# Altium schematic sheet LPCB227 - ACCELS.SchDoc
size A3; Address1: Factory 10; Address2: 9-13 Dingley Avenue, Dandeong, VICTORIA 3175, AUSTRALIA; DocumentNumber: 2; Revision: 1; SheetNumber: 2; SheetTotal: 4; Lockie__PCB_SUB_ASSEMBLY: Accelerometers; Lockie__PCB_ASSEMBLY: Main; Lockie__LDL: LPCB227; Lockie__PCB_DESCRIPTION: Accelerometer Module
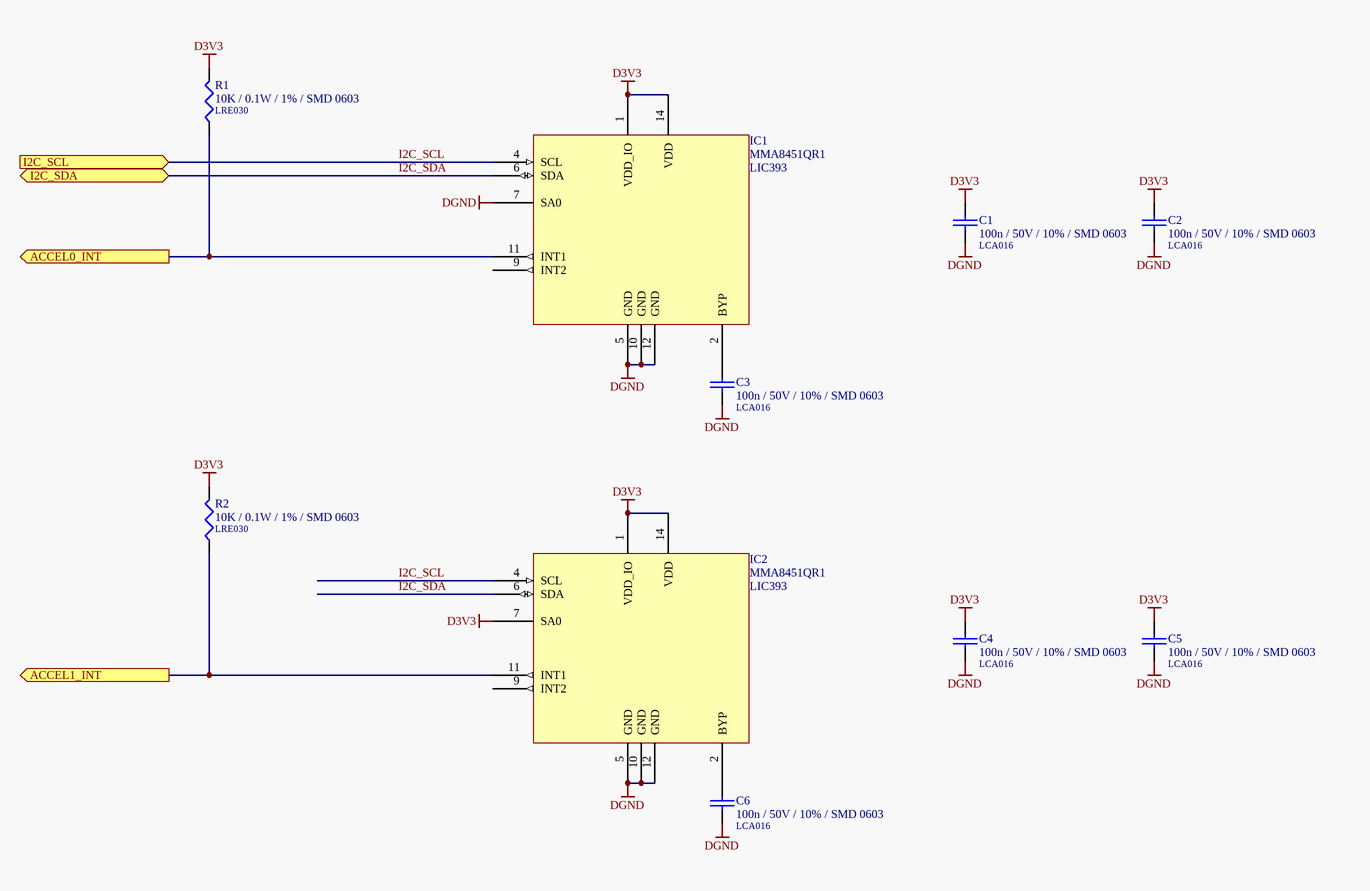
[diagram p0: LPCB227 - ACCELS.SchDoc]

## Parts
C1  100n / 50V / 10% / SMD 0603  LDL_NUMBER: LCA016  [LFP011__CC1608-0603-IPC7351_B]
C2  100n / 50V / 10% / SMD 0603  LDL_NUMBER: LCA016  [LFP011__CC1608-0603-IPC7351_B]
C3  100n / 50V / 10% / SMD 0603  LDL_NUMBER: LCA016  [LFP011__CC1608-0603-IPC7351_B]
C4  100n / 50V / 10% / SMD 0603  LDL_NUMBER: LCA016  [LFP011__CC1608-0603-IPC7351_B]
C5  100n / 50V / 10% / SMD 0603  LDL_NUMBER: LCA016  [LFP011__CC1608-0603-IPC7351_B]
C6  100n / 50V / 10% / SMD 0603  LDL_NUMBER: LCA016  [LFP011__CC1608-0603-IPC7351_B]
IC1  MMA8451QR1  LDL_NUMBER: LIC393  [LFP051__QFN16]
IC2  MMA8451QR1  LDL_NUMBER: LIC393  [LFP051__QFN16]
R1  10K / 0.1W / 1% / SMD 0603  LDL_NUMBER: LRE030  [LFP020__CR1608-0603-IPC7351_B]
R2  10K / 0.1W / 1% / SMD 0603  LDL_NUMBER: LRE030  [LFP020__CR1608-0603-IPC7351_B]

## Ports
ACCEL0_INT (out), ACCEL1_INT (out), I2C_SCL (in), I2C_SDA (bidir)

## Nets
D3V3: C1.1 C2.1 C4.1 C5.1 IC1.1(VDD_IO) IC1.14(VDD) IC2.1(VDD_IO) IC2.7(SA0) IC2.14(VDD) R1.2 R2.2
DGND: C1.2 C2.2 C3.2 C4.2 C5.2 C6.2 IC1.5(GND) IC1.7(SA0) IC1.10(GND) IC1.12(GND) IC2.5(GND) IC2.10(GND) IC2.12(GND)
ACCEL0_INT: IC1.11(INT1) R1.1 ; port ACCEL0_INT
ACCEL1_INT: IC2.11(INT1) R2.1 ; port ACCEL1_INT
I2C_SCL: IC1.4(SCL) IC2.4(SCL) ; port I2C_SCL
I2C_SDA: IC1.6(SDA) IC2.6(SDA) ; port I2C_SDA
NetC3_1: C3.1 IC1.2(BYP)
NetC6_1: C6.1 IC2.2(BYP)

Not connected (* = marked no-connect by the designer): IC1 9(INT2); IC2 9(INT2)

## Notes on the sheet
- PCB COMPONENT DESCRIPTION
- LDL NUMBER
- Assembly Details
- Size
- Drawing File Name
- Revision
- http://rloop.org
- Scale
- A3
- Sheet Details
- N.T.S
- Sheet:
- Of:

## Library data of the parts
C1-C6 = 100n / 50V / 10% / SMD 0603: Capacitor, Ceramic Chip, 100nF (0.1uF), 50V, 5%, SMD 0603 [LCA016]; FMEDA__OPERATING__VOLTAGE_MIN: 0; FMEDA__OPERATING__VOLTAGE_MAX: 3.3; FMEDA__OPERATING__TEMP_MIN: -20; FMEDA__OPERATING__TEMP_TYP: 27; FMEDA__OPERATING__TEMP_MAX: 50; FMEDA__CHANNEL: COM; Value: 100n; FMEDA__FUNCTION_IN_SYSTEM: *; FMEDA__OPERATING__VOLTAGE_TYP: 3.3
IC1 IC2 = MMA8451QR1: IC, Accelerometer, 3-Axis, 3.3V, I2C, SMD QFN16 [LIC393]; FMEDA__OPERATING__TEMP_MAX: 50; FMEDA__OPERATING__TEMP_MIN: -20; FMEDA__OPERATING__TEMP_TYP: 27; FMEDA__OPERATING__VOLTAGE_MAX: 3.3; FMEDA__OPERATING__VOLTAGE_MIN: 0; FMEDA__CHANNEL: COM; FMEDA__OPERATING__VOLTAGE_TYP: 3.3; FMEDA__FUNCTION_IN_SYSTEM: *
R1 R2 = 10K / 0.1W / 1% / SMD 0603: Resistor, Ceramic Chip, 10K, 0.1W, 1%, SMD 0603 [LRE030]; FMEDA__OPERATING__POWER_MAX: 0; FMEDA__OPERATING__TEMP_MAX: 50; FMEDA__OPERATING__TEMP_MIN: -20; FMEDA__OPERATING__TEMP_TYP: 27; FMEDA__CHANNEL: COM; Value: 10K; FMEDA__OPERATING__POWER_MIN: 0; FMEDA__OPERATING__VOLTAGE_MAX: 0; FMEDA__OPERATING__VOLTAGE_MIN: 0; FMEDA__OPERATING__VOLTAGE_TYP: 0; FMEDA__FUNCTION_IN_SYSTEM: *